# EAGLE schematic CAN_board (EAGLE 7.1.0)
DESCRIPTION: microOBD 200 OBD-II Module; HW_REV: 1.4; PCB_REV: C; PCB_SPEC1: Layer Count: 4; PCB_SPEC2: Size: 1.3" x 0.59"; PCB_SPEC3: Finish Thickness: 0.049" - 0.052"; PCB_SPEC4: Copper Weight: 1oz; TITLE: STM1120
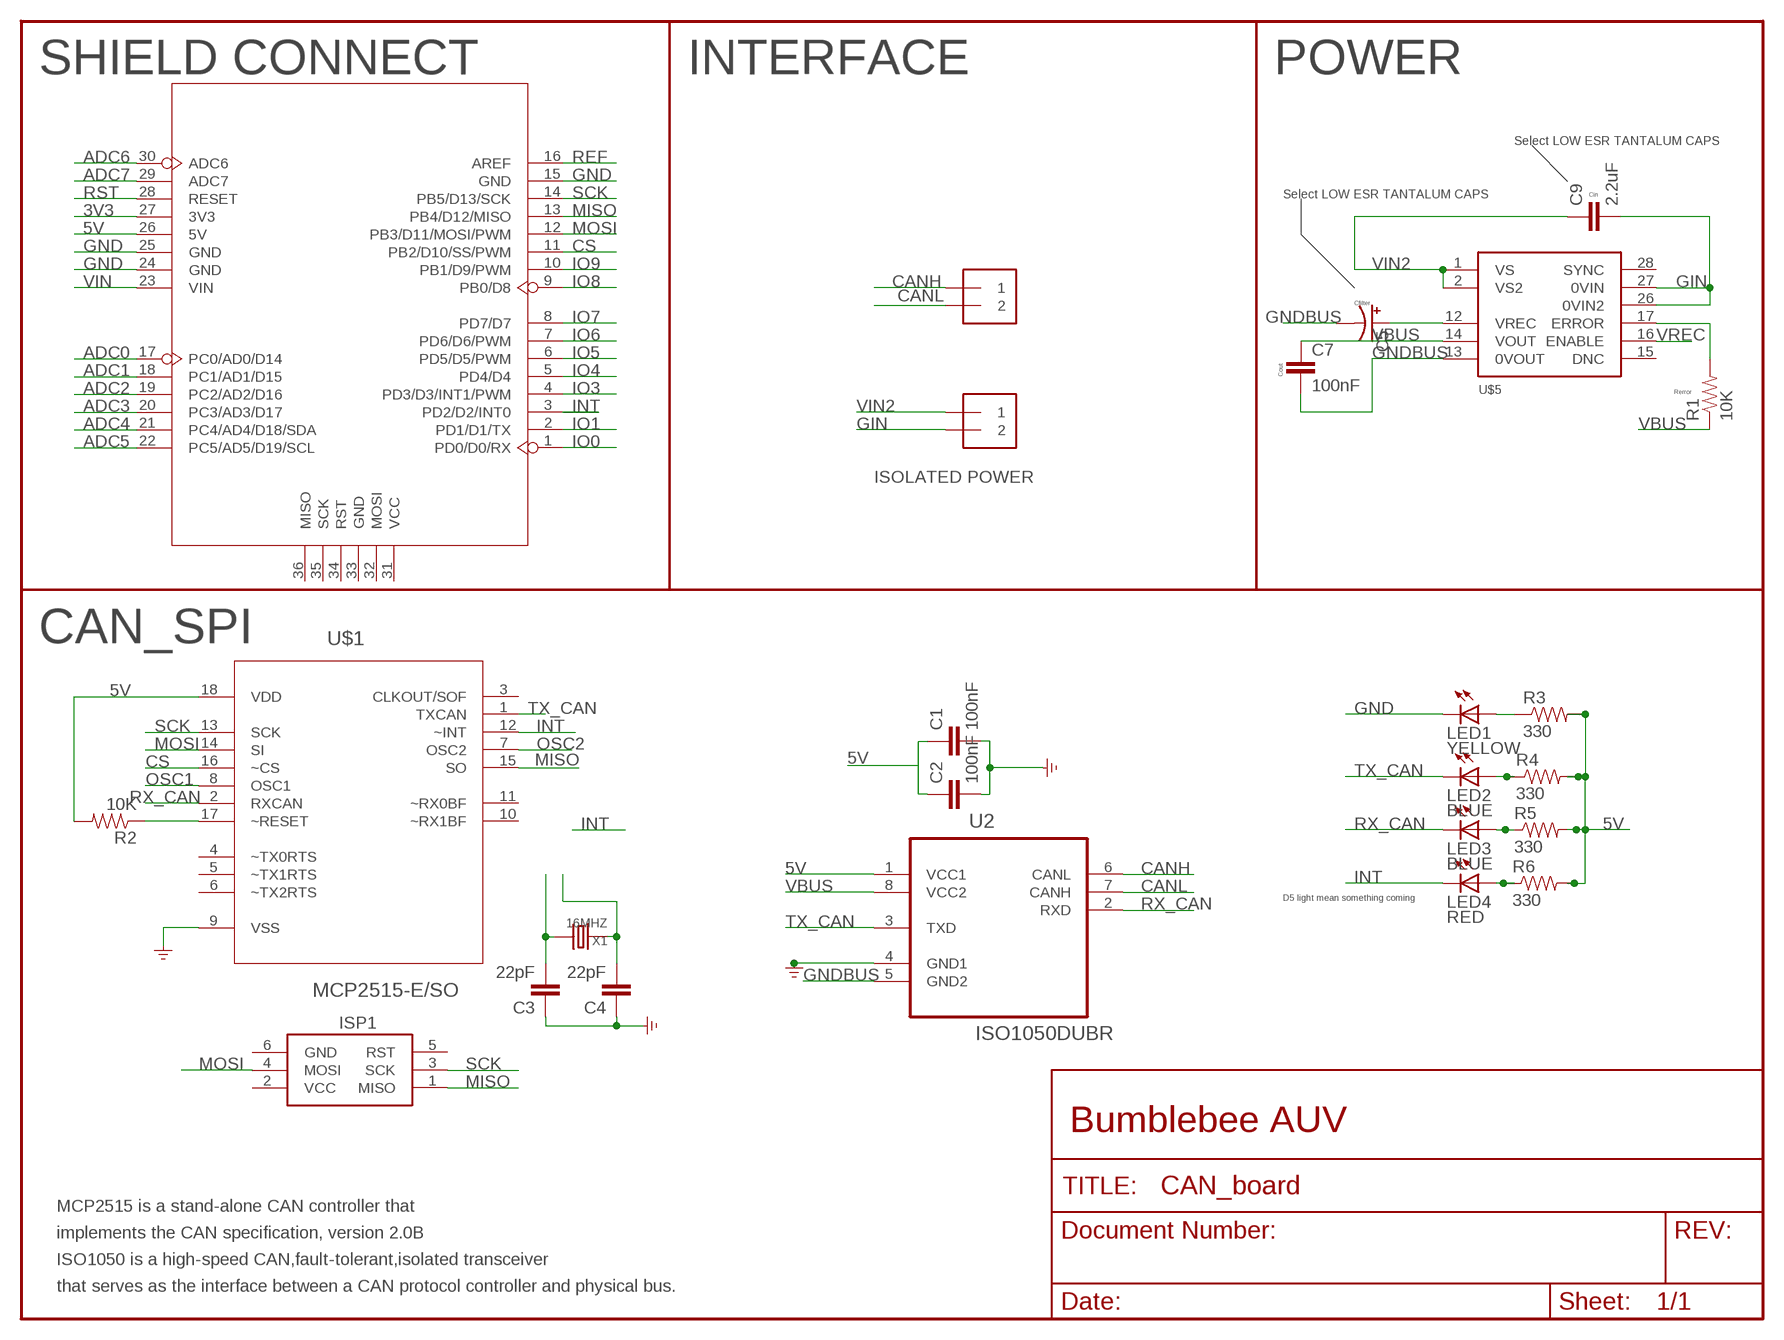
[diagram p0: schematic, sheet 1]

## Parts
C1  100nF  1UF-25V-10%(0805)  [0805]
C2  100nF  1UF-25V-10%(0805)  [0805]
C3  22pF  1UF-25V-10%(0805)  [0805]
C4  22pF  1UF-25V-10%(0805)  [0805]
C5  CAP_POL6032  [EIA6032]
C7  100nF  1UF-25V-10%(0805)  [0805]
C9  2.2uF  CAP0603-CAP  [0603-CAP]
ISP1  AVRISP-6  [AVRISP]
J0  1X2-3.5MM  [1X2-3.5MM]
J1  1X2-3.5MM  [1X2-3.5MM]
LED1  YELLOW  LEDCHIPLED_0805  [CHIPLED_0805]
LED2  BLUE  LEDCHIPLED_0805  [CHIPLED_0805]
LED3  BLUE  LEDCHIPLED_0805  [CHIPLED_0805]
LED4  RED  LEDCHIPLED_0805  [CHIPLED_0805]
R1  10K  RESISTOR0805-RES  [0805]
R2  10K  RESISTOR0805-RES  [0805]
R3  330  RESISTOR0805-RES  [0805]
R4  330  RESISTOR0805-RES  [0805]
R5  330  RESISTOR0805-RES  [0805]
R6  330  RESISTOR0805-RES  [0805]
U2  ISO1050DUBR  [SOIC254P1040X485-8N]
U3  ARDUINO  [ARDUINO]
U$1  MCP2515-E/SO  [SOIC127P1030X265-18N]
U$5  DCR01SO  [DCR01-SOIC28]
X1  16MHZ  CRYSTAL  [HC49US]

## Nets
3V3: U3.27(3V3)
5V: C1.1 C2.1 R2.2 R3.2 R4.2 R5.2 R6.2 U3.26(5V) U$1.18(VDD)
ADC0: U3.17(PC0/AD0/D14)
ADC1: U3.18(PC1/AD1/D15)
ADC2: U3.19(PC2/AD2/D16)
ADC3: U3.20(PC3/AD3/D17)
ADC4: U3.21(PC4/AD4/D18/SDA)
ADC5: U3.22(PC5/AD5/D19/SCL)
ADC6: U3.30(ADC6)
ADC7: U3.29(ADC7)
CANH: J0.1
CANL: J0.2
CS: U3.11(PB2/D10/SS/PWM)
ERROR: R1.2 U$5.17(ERROR)
GIN: C9.2 J1.2 U$5.26(0VIN2) U$5.27(0VIN)
GND: C1.2 C2.2 C3.1 C4.1 LED1.C U3.15(GND) U3.24(GND) U3.25(GND) U$1.9(VSS)
GNDBUS: C5.P$2(-) C7.2 U$5.13(0VOUT)
INT: LED4.C U3.3(PD2/D2/INT0) U$1.12(~INT)
IO0: U3.1(PD0/D0/RX)
IO1: U3.2(PD1/D1/TX)
IO3: U3.4(PD3/D3/INT1/PWM)
IO4: U3.5(PD4/D4)
IO5: U3.6(PD5/D5/PWM)
IO6: U3.7(PD6/D6/PWM)
IO7: U3.8(PD7/D7)
IO8: U3.9(PB0/D8)
IO9: U3.10(PB1/D9/PWM)
MISO: ISP1.1(MISO) U3.13(PB4/D12/MISO)
MOSI: ISP1.4(MOSI) U3.12(PB3/D11/MOSI/PWM)
N$1: LED1.A R3.1
N$2: LED2.A R4.1
N$3: R2.1 U$1.17(~RESET)
N$15: LED3.A R5.1
N$19: LED4.A R6.1
OSC1: C3.2 U$1.8(OSC1) X1.2
OSC2: C4.2 U$1.7(OSC2) X1.1
REF: U3.16(AREF)
RST: U3.28(RESET)
RX_CAN: LED3.C
SCK: ISP1.3(SCK) U3.14(PB5/D13/SCK)
TX_CAN: LED2.C
VBUS: C7.1 R1.1 U$5.14(VOUT)
VIN: U3.23(VIN)
VIN2: C9.1 J1.1 U$5.1(VS) U$5.2(VS2)
VREC: C5.P$1(+) U$5.12(VREC) U$5.16(ENABLE)
Unconnected: ISP1.5(RST) U2.2(RXD) U2.3(TXD) U2.4(GND1) U2.5(GND2) U2.6(CANL) U2.7(CANH) U3.31(VCC) U3.32(MOSI) U3.33(GND) U3.34(RST) U3.35(SCK) U3.36(MISO) U$1.1(TXCAN) U$1.2(RXCAN) U$1.3(CLKOUT/SOF) U$1.4(~TX0RTS) U$1.5(~TX1RTS) U$1.6(~TX2RTS) U$1.10(~RX1BF) U$1.11(~RX0BF) U$1.13(SCK) U$1.14(SI) U$1.15(SO) U$1.16(~CS) U$5.15(DNC) U$5.28(SYNC)

## Notes on the sheet
- SHIELD CONNECT | INTERFACE | POWER
- Select LOW ESR TANTALUM CAPS
- Cin
- Select LOW ESR TANTALUM CAPS
- Cfilter
- Cout
- Rerror
- ISOLATED POWER
- CAN_SPI
- D5 light mean something coming
- Bumblebee AUV
- MCP2515 is a stand-alone CAN controller that
- implements the CAN specification, version 2.0B
- ISO1050 is a high-speed CAN,fault-tolerant,isolated transceiver
- that serves as the interface between a CAN protocol controller and physical bus.

## Power pins joined to a net without a drawn wire
GND: ISP1.6(GND)
VCC: ISP1.2(VCC)
VCC1: U2.1(VCC1)
VCC2: U2.8(VCC2)

## Library data of the parts
C1 C2 C7 = SparkFun-Capacitors:1UF-25V-10%(0805): CAP-08064; OC_NEWARK: unknown; PROD_ID: CAP-08064; VALUE: 1uF
C3 C4 = SparkFun-Capacitors:1UF-25V-10%(0805): CAP-08064; MPN: MC0603N220K500CT; OC_NEWARK: 06R5152; PROD_ID: CAP-08064; VALUE: 1uF
C5 = SparkFun-Capacitors:CAP_POL: Capacitor Polarized These are standard SMD and PTH capacitors. Normally 10uF, 47uF, and 100uF in electrolytic and tantalum varieties. Always verify the external diameter of the through hole cap, it varies with capacity, voltage, and manufacturer. The EIA devices should be standard.
C9 = SparkFun-Passives:CAP: Capacitor Standard 0603 ceramic capacitor, and 0.1" leaded capacitor.
ISP1 = adafruit:AVRISP: AVR ISP HEADER Standard 6 pin header for AVR programming; OC_NEWARK: unknown
J0 J1 = adafruit:1X2: 3.5mm Terminal block http://www.ladyada.net/library/pcb/eaglelibrary.html; OC_NEWARK: unknown
LED1-LED4 = adafruit:LED: LED OSRAM: - CHIPLED LG R971, LG N971, LY N971, LG Q971, LY Q971, LO R971, LY R971 LH N974, LH R974 LS Q976, LO Q976, LY Q976 LO Q996 - Hyper CHIPLED LW Q18S LB Q993, LB Q99A, LB R99A - SideLED LS A670, LO A670, LY A670, LG A670, LP A670 LB A673, LV A673, LT A673, LW A673 LH A674 LY A675 LS A676, LA A676, LO A676, LY A676, LW A676 LS A679, LY A679, LG A679 - Hyper Micro SIDELED® LS Y876, LA Y876, LO Y876, LY Y876 LT Y87S - SmartLED LW L88C, LW L88S LB L89C, LB L89S, LG L890 LS L89K, LO L89K, LY L89K LS L896, LA L896, LO L896, LY L896 - TOPLED LS T670, LO T670, LY T670, LG T670, LP T670 LSG T670, LSP T670, LSY T670, LOP T670, LYG T670 LG T671, LOG T671, LSG T671 LB T673, LV T673, LT T673, LW T673 LH T674 LS T676, LA T676, LO T676, LY T676, LB T676, LH T676, LSB T676, LW T676 LB T67C, LV T67C, LT T67C, LS T67K, LO T67K, LY T67K, LW E67C LS E67B, LA E67B, LO E67B, LY E67B, LB E67C, LV E67C, LT E67C LW T67C LS T679, LY T679, LG T679 LS T770, LO T770, LY T770, LG T770, LP T770 LB T773, LV T773, LT T773, LW T773 LH T774 LS E675, LA E675, LY E675, LS T675 LS T776, LA T776, LO T776, LY T776, LB T776 LHGB T686 LT T68C, LB T68C - Hyper Mini TOPLED® LB M676 - Mini TOPLED Santana® LG M470 LS M47K, LO M47K, LY M47K Source: http://www.osram.convergy.de/; OC_NEWARK: unknown
R1 R2 = SparkFun-Passives:RESISTOR: Resistor Basic schematic elements and footprints for 0603, 1206, and PTH resistors.; OC_NEWARK: unknown
R3-R6 = SparkFun-Resistors:RESISTOR: Resistor Basic schematic elements and footprints for 0603, 1206, and PTH resistors.; OC_NEWARK: unknown
U2 = CAN-Controller-Library:ISO1050DUBR: ISOLATED CAN TRANSCEIVER; MPN: ISO1050DUBR; OC_FARNELL: 2118645; OC_NEWARK: 14R9899; PACKAGE: DIP-8; SUPPLIER: TEXAS INSTRUMENTS
U3 = Module:ARDUINO; OC_NEWARK: unknown
U$1 = CAN-Controller-Library:MCP2515-E/SO: Stand-Alone CAN Controller; DESCRIPTION: IC CAN CONTROLLER; MPN: MCP2515-E/SO; OC_FARNELL: 1605565; OC_NEWARK: 29H7134; PACKAGE: SOIC-18; SUPPLIER: Microchip
U$5 = bbauv:DCR01: The DCR01 family is a series of high-efficiency, input-isolated, output-regulated DC/DC converters. In addition to 1W nominal, galvanically-isolated output power capability, this range of DC/DCs offer very low output noise, thermal protection, and high accuracy. The DCR01 family is implemented in standard molded IC packaging, giving standard JEDEC outlines suitable for high-volume assembly. The DCR01 is manufactured using the same technology as standard IC packages, thereby achieving very high reliability.
X1 = Discrete:CRYSTAL*; MF: CITIZEN AMERICA, CORPORATION; MPN: HC49US16.000MABJ-UB; OC_NEWARK: 59K8183

## Net classes
0 default: width 0.203 mm, drill 0.305 mm, clearance 0.203 mm